# Altium schematic sheet Sheet2.SchDoc
size A3; SheetNumber: 2; SheetTotal: 2
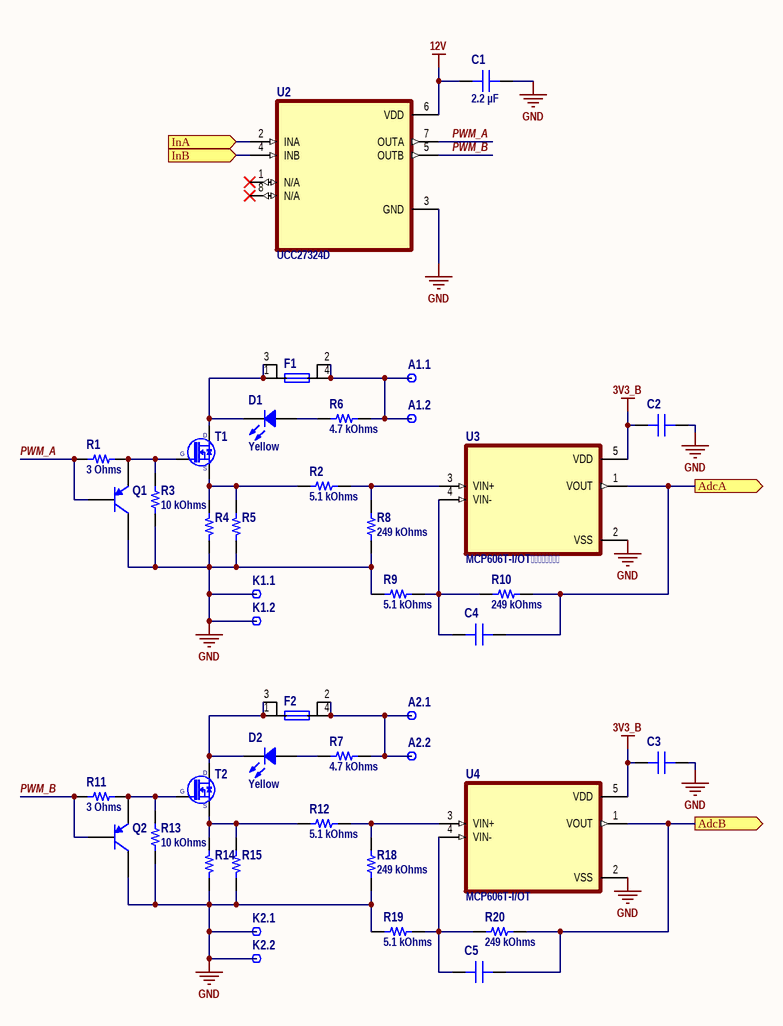
[diagram p0: Sheet2.SchDoc]

## Parts
A1.1  Plated Hole  [MTG240_400]  (value not drawn)
A1.2  Plated Hole  [MTG240_400]  (value not drawn)
A2.1  Plated Hole  [MTG240_400]  (value not drawn)
A2.2  Plated Hole  [MTG240_400]  (value not drawn)
C1  2.2 µF  [CAP 0805_2012]
C2  1000 pF  [CAP 0603_1608]  (value not drawn)
C3  1000 pF  [CAP 0603_1608]  (value not drawn)
C4  6800 pF  [CAP 0603_1608]  (value not drawn)
C5  6800 pF  [CAP 0603_1608]  (value not drawn)
D1  Yellow  [LED 0603_1608 YELLOW]
D2  Yellow  [LED 0603_1608 YELLOW]
F1  (no value)  [FUSR_LITTELFUSE_RHEF100 - duplicate]
F2  (no value)  [FUSR_LITTELFUSE_RHEF100 - duplicate]
K1.1  Plated Hole  [MTG240_400]  (value not drawn)
K1.2  Plated Hole  [MTG240_400]  (value not drawn)
K2.1  Plated Hole  [MTG240_400]  (value not drawn)
K2.2  Plated Hole  [MTG240_400]  (value not drawn)
Q1  FMMT718TA  [SOT-23B_N]  (value not drawn)
Q2  FMMT718TA  [SOT-23B_N]  (value not drawn)
R1  3 Ohms  [RES 0805_2012]
R2  5.1 kOhms  [RES 0603_1608]
R3  10 kOhms  [RES 0805_2012]
R4  10 mOhms  [RES 2512_6432]  (value not drawn)
R5  10 mOhms  [RES 2512_6432]  (value not drawn)
R6  4.7 kOhms  [RES 0603_1608]
R7  4.7 kOhms  [RES 0603_1608]
R8  249 kOhms  [RES 0603_1608]
R9  5.1 kOhms  [RES 0603_1608]
R10  249 kOhms  [RES 0603_1608]
R11  3 Ohms  [RES 0805_2012]
R12  5.1 kOhms  [RES 0603_1608]
R13  10 kOhms  [RES 0805_2012]
R14  10 mOhms  [RES 2512_6432]  (value not drawn)
R15  10 mOhms  [RES 2512_6432]  (value not drawn)
R18  249 kOhms  [RES 0603_1608]
R19  5.1 kOhms  [RES 0603_1608]
R20  249 kOhms  [RES 0603_1608]
T1  (no value)  [TO-220]
T2  (no value)  [TO-220]
U2  UCC27324D  [8-SOIC]
U3  MCP606T-I/OT  [SOT95P270X145-5N]
U4  MCP606T-I/OT  [SOT95P270X145-5N]

## Ports
AdcA (out), AdcB (out), InA (in), InB (in)

## Nets
3V3_B: C2.2 C3.2 U3.5(VDD) U4.5(VDD)
12V: C1.2 U2.6(VDD)
GND: C1.1 C2.1 C3.1 K1.1.1 K1.2.1 K2.1.1 K2.2.1 Q1.1(C) Q2.1(C) R3.1 R4.2 R5.2 R8.1 R9.1 R13.1 R14.2 R15.2 R18.1 R19.1 U2.3(GND) U3.2(VSS) U4.2(VSS)
AdcA: C4.2 R10.2 U3.1(VOUT) ; port AdcA
AdcB: C5.2 R20.2 U4.1(VOUT) ; port AdcB
InA: U2.2(INA) ; port InA
InB: U2.4(INB) ; port InB
PWM_A: Q1.2(B) R1.1 U2.7(OUTA)
PWM_B: Q2.2(B) R11.1 U2.5(OUTB)
NetA1.1_1: A1.1.1 A1.2.1 F1.2 F1.4 R6.2
NetA2.1_1: A2.1.1 A2.2.1 F2.2 F2.4 R7.2
NetC4_1: C4.1 R9.2 R10.1 U3.4(VIN-)
NetC5_1: C5.1 R19.2 R20.1 U4.4(VIN-)
NetD1_1: D1.1 R6.1
NetD1_2: D1.2 F1.1 F1.3 T1.2(D)
NetD2_1: D2.1 R7.1
NetD2_2: D2.2 F2.1 F2.3 T2.2(D)
NetQ1_3: Q1.3(E) R1.2 R3.2 T1.1(G)
NetQ2_3: Q2.3(E) R11.2 R13.2 T2.1(G)
NetR2_1: R2.1 R4.1 R5.1 T1.3(S)
NetR2_2: R2.2 R8.2 U3.3(VIN+)
NetR12_1: R12.1 R14.1 R15.1 T2.3(S)
NetR12_2: R12.2 R18.2 U4.3(VIN+)

Not connected (* = marked no-connect by the designer): U2 1(N/A)* 8(N/A)*

## Library data of the parts
A1.1 A1.2 A2.1 A2.2 K1.1 K1.2 K2.1 K2.2 = PLATED_HOLE2.4_PAD4.0: Single Terminal Socket; Part Description: Plated Through Hole: Hole Dia.=2.4mm Pad Dia.=4.0mm; Mounted: No; Part Number: PLATED_HOLE2.4_PAD4.0; Component Kind: Standard (No BOM); Component Type: Standard (No BOM); Pin Count: 1; Family: Plated Hole; Socket: No; SMD: No; Sense: No; Status: None; ComponentHeight: 0mm; HelpURL: Undefined; Author: CERN DEM JMW; CreateDate: 10.10.2011; LatestRevisionDate: 10.10.2011; PackageDescription: Plated Through Hole: Hole Dia.=2.4mm Pad Dia.=4.0mm
C1 = C0805C225K3PAC7800: CAP CER 2.2UF 25V X5R 0805; manufacturer: KEMET; Tolerance: ±10%; Part Number: C0805C225K3PAC7800; Value: 2.2 µF; Applications: General Purpose; Capacitance: 2.2 µF; componentlink1description: Datasheet; componentlink1url: https://api.kemet.com/component-edge/download/datasheet/C0805C225K3PAC7800.pdf; componentlink2description: DigiKey Link; componentlink2url: https://www.digikey.com/en/products/detail/kemet/C0805C225K3PAC7800/5267605; Device Package: 0805 (2012 Metric); lastupdated: 26.02.2022 9:08:50; Lifecycle Status: Active; Minimum Order: 1; Mounting Type: Surface Mount, MLCC; Operating Temperature: -55°C ~ 85°C; Package / Case: 0805 (2012 Metric); packaging: TapeAndReel; partid: 8494; Part Status: Active; price: 0.04; series: SMD Comm X5R; Size / Dimension: 0.079" L x 0.049" W (2.00mm x 1.25mm); Supplier 1: DigiKey; Supplier Part Number 1: 399-11940-1-ND; Temperature Coefficient: X5R; Thickness (Max): 0.055" (1.40mm); Voltage - Rated: 25V
C2 C3 = CC0603JPX7R9BB102: CAP CER 1000PF 50V X7R 0603; manufacturer: Yageo; Tolerance: ±5%; Part Number: CC0603JPX7R9BB102; Value: 1000 pF; Applications: General Purpose; Capacitance: 1000 pF; componentlink1description: Datasheet; componentlink1url: https://www.yageo.com/upload/media/product/productsearch/datasheet/mlcc/UPY-GPHC_X7R_6.3V-to-50V_20.pdf; componentlink2description: DigiKey Link; componentlink2url: https://www.digikey.com/en/products/detail/yageo/CC0603JPX7R9BB102/11490764; Device Package: 0603 (1608 Metric); lastupdated: 26.02.2022 9:05:02; Lifecycle Status: Active; Minimum Order: 1; Mounting Type: Surface Mount, MLCC; Operating Temperature: -55°C ~ 125°C; Package / Case: 0603 (1608 Metric); packaging: TapeAndReel; partid: 35065; Part Status: Active; price: 0.01; series: CC; Size / Dimension: 0.063" L x 0.031" W (1.60mm x 0.80mm); Supplier 1: DigiKey; Supplier Part Number 1: 13-CC0603JPX7R9BB102CT-ND; Temperature Coefficient: X7R; Thickness (Max): 0.035" (0.90mm); Voltage - Rated: 50V
C4 C5 = CC0603KRX7R8BB682: CAP CER 6800PF 25V X7R 0603; manufacturer: Yageo; Tolerance: ±10%; Part Number: CC0603KRX7R8BB682; Value: 6800 pF; Applications: General Purpose; Capacitance: 6800 pF; componentlink1description: Datasheet; componentlink1url: https://www.yageo.com/upload/media/product/productsearch/datasheet/mlcc/UPY-GPHC_X7R_6.3V-to-50V_18.pdf; componentlink2description: DigiKey Link; componentlink2url: https://www.digikey.com/en/products/detail/yageo/CC0603KRX7R8BB682/5883791; Device Package: 0603 (1608 Metric); lastupdated: 26.02.2022 9:05:31; Lifecycle Status: Active; Minimum Order: 1; Mounting Type: Surface Mount, MLCC; Operating Temperature: -55°C ~ 125°C; Package / Case: 0603 (1608 Metric); packaging: TapeAndReel; partid: 15819; Part Status: Active; price: 0.01; series: CC; Size / Dimension: 0.063" L x 0.031" W (1.60mm x 0.80mm); Supplier 1: DigiKey; Supplier Part Number 1: 311-4090-1-ND; Temperature Coefficient: X7R; Thickness (Max): 0.035" (0.90mm); Voltage - Rated: 25V
D1 D2 = XZM2CYK53W-1: LED YELLOW CLEAR 2SMD; Manufacturer: SunLED; Configuration: Standard; Current - Test: 20mA; Lens Color: Colorless; Lens Size: 1.10mm x 0.80mm; Lens Style: Rectangle with Flat Top; Millicandela Rating: 317mcd; Viewing Angle: 120°; Voltage - Forward (Vf) (Typ): 2V; Wavelength - Dominant: 590nm; Part Number: XZM2CYK53W-1; Color: Yellow; ComponentLink1Description: Datasheet; ComponentLink1URL: https://www.sunledusa.com/products/spec/XZM2CYK53W-1.pdf; ComponentLink2Description: DigiKey Link; ComponentLink2URL: http://digikey.com/product-detail/en/sunled/XZM2CYK53W-1/1497-1236-1-ND/5001283; Device Package: 0603 (1608 Metric); Height (Max): 0.75mm; LastUpdated: 02.09.2020 1:21:18; Lens Transparency: Clear; Lifecycle Status: Active; Minimum Order: 1; Mounting Type: Surface Mount; Package / Case: 0603 (1608 Metric); Packaging: TapeAndReel; PartId: 102; Part Status: Active; Price: 0.15; Series: -; Size / Dimension: 1.60mm L x 0.80mm W; Supplier 1: DigiKey; Supplier Part Number 1: 1497-1236-1-ND; Supplier Device Package: 2-SMD; Value: Yellow; Wavelength - Peak: 590nm
F1 F2 = Fuse_auto: Fuse
Q1 Q2 = PNP: PNP Bipolar Transistor; Published: 8-Jun-2000; LatestRevisionDate: 29-May-2009; LatestRevisionNote: IPC-7351 Footprint Added.; PackageVersion: Aug-1999; PackageReference: SOT-23B; Publisher: Altium Limited; PackageDescription: 3-Pin SOT-23 Package 0.95 mm Pitch, 2.4 mm Lead Span
R1 R11 = RC0805JR-073RL: RES 3 OHM 5% 1/8W 0805; Manufacturer: Yageo; Power (Watts): 0.125W, 1/8W; Temperature Coefficient: ±200ppm/°C; Part Number: RC0805JR-073RL; Value: 3 Ohms; ComponentLink1Description: Datasheet; ComponentLink1URL: https://www.yageo.com/upload/media/product/productsearch/datasheet/rchip/PYu-RC_Group_51_RoHS_L_10.pdf; ComponentLink2Description: DigiKey Link; ComponentLink2URL: https://www.digikey.com/en/products/detail/yageo/RC0805JR-073RL/728295; Composition: Thick Film; Device Package: 0805 (2012 Metric); Features: Moisture Resistant; Height - Seated (Max): 0.024" (0.60mm); LastUpdated: 28.02.2022 16:27:14; Lifecycle Status: Active; Minimum Order: 1; Number of Terminations: 2; Operating Temperature: -55°C ~ 155°C; Package / Case: 0805 (2012 Metric); Packaging: TapeAndReel; PartId: 28655; Part Status: Active; Price: 0.01; Resistance: 3 Ohms; Series: RC_L; Size / Dimension: 0.079" L x 0.049" W (2.00mm x 1.25mm); Supplier 1: DigiKey; Supplier Part Number 1: 311-3.0ARCT-ND; Supplier Device Package: 0805; Tolerance: ±5%
R2 R9 R12 R19 = TNPW06035K10BYEN: RES 5.1K OHM 0.1% 1/10W 0603; Manufacturer: Vishay Dale; Power (Watts): 0.125W, 1/8W; Temperature Coefficient: ±10ppm/°C; Part Number: TNPW06035K10BYEN; Value: 5.1 kOhms; ComponentLink1Description: Datasheet; ComponentLink1URL: http://www.vishay.com/docs/28758/tnpw_e3.pdf; ComponentLink2Description: DigiKey Link; ComponentLink2URL: http://digikey.com/product-detail/en/vishay-dale/TNPW06035K10BYEN/541-9831-1-ND/9562456; Composition: Thin Film; Device Package: 0603 (1608 Metric); Features: Anti-Sulfur, Automotive AEC-Q200, Moisture Resistant; Height - Seated (Max): 0.022" (0.55mm); LastUpdated: 26.02.2022 8:48:05; Lifecycle Status: Active; Minimum Order: 1; Number of Terminations: 2; Operating Temperature: -55°C ~ 155°C; Package / Case: 0603 (1608 Metric); Packaging: TapeAndReel; PartId: 5273; Part Status: Active; Price: 0.27; Ratings: AEC-Q200; Resistance: 5.1 kOhms; Series: TNPW e3; Size / Dimension: 0.061" L x 0.033" W (1.55mm x 0.85mm); Supplier 1: DigiKey; Supplier Part Number 1: 541-9831-1-ND; Supplier Device Package: 0603; Tolerance: ±0.1%
R3 R13 = RC0805JR-0710KP: RES SMD 10K OHM 5% 1/8W 0805; Manufacturer: Yageo; Power (Watts): 0.125W, 1/8W; Temperature Coefficient: ±100ppm/°C; Part Number: RC0805JR-0710KP; Value: 10 kOhms; ComponentLink1Description: Datasheet; ComponentLink1URL: http://www.yageo.com/NewPortal/yageodocoutput?fileName=/pdf/R-Chip/PYu-RC_51_RoHS_P_0.pdf; ComponentLink2Description: DigiKey Link; ComponentLink2URL: https://www.digikey.com/en/products/detail/yageo/RC0805JR-0710KP/4935344; Composition: Thick Film; Device Package: 0805 (2012 Metric); Features: Moisture Resistant; Height - Seated (Max): 0.024" (0.60mm); LastUpdated: 26.02.2022 8:57:19; Lifecycle Status: Active; Minimum Order: 1; Number of Terminations: 2; Operating Temperature: -55°C ~ 155°C; Package / Case: 0805 (2012 Metric); Packaging: TapeAndReel; PartId: 47029; Part Status: Active; Price: 0.01; Resistance: 10 kOhms; Series: RC-P Lead Free; Size / Dimension: 0.079" L x 0.049" W (2.00mm x 1.25mm); Supplier 1: DigiKey; Supplier Part Number 1: YAG1329CT-ND; Supplier Device Package: 0805; Tolerance: ±5%
R4 R5 R14 R15 = RL2512FK-070R01L: RES 0.01 OHM 1% 1W 2512; Manufacturer: Yageo; Temperature Coefficient: ±1500ppm/°C; Part Number: RL2512FK-070R01L; ComponentLink1Description: Datasheet; ComponentLink1URL: http://www.yageo.com/documents/recent/PYu-RL_Group_521_RoHS_L_2.pdf; ComponentLink2Description: DigiKey Link; ComponentLink2URL: https://www.digikey.com/en/products/detail/yageo/RL2512FK-070R01L/1037140; Composition: Thick Film; Device Package: 2512 (6432 Metric); Features: Automotive AEC-Q200, Current Sense, Moisture Resistant; Height - Seated (Max): 0.026" (0.65mm); LastUpdated: 17.02.2022 18:29:30; Lifecycle Status: Active; Minimum Order: 1; Number of Terminations: 2; Operating Temperature: -55°C ~ 155°C; Package / Case: 2512 (6432 Metric); Packaging: TapeAndReel; Part Status: Active; Power (Watts): 1W; Price: 0.15; Ratings: AEC-Q200; Resistance: 10 mOhms; Series: RL; Size / Dimension: 0.250" L x 0.126" W (6.35mm x 3.20mm); Supplier 1: DigiKey; Supplier Part Number 1: 311-.010TCT-ND; Supplier Device Package: 2512; Tolerance: ±1%; Value: 10 mOhms
R6 R7 = RC0603JR-134K7L: RES 4.7K OHM 5% 1/10W 0603; Manufacturer: Yageo; Power (Watts): 0.1W, 1/10W; Temperature Coefficient: ±100ppm/°C; Part Number: RC0603JR-134K7L; Value: 4.7 kOhms; ComponentLink1Description: Datasheet; ComponentLink1URL: https://www.yageo.com/upload/media/product/productsearch/datasheet/rchip/PYu-RC_Group_51_RoHS_L_11.pdf; ComponentLink2Description: DigiKey Link; ComponentLink2URL: https://www.digikey.com/en/products/detail/yageo/RC0603JR-134K7L/13694157; Composition: Thick Film; Device Package: 0603 (1608 Metric); Features: Moisture Resistant; Height - Seated (Max): 0.022" (0.55mm); LastUpdated: 26.02.2022 8:46:15; Lifecycle Status: Active; Minimum Order: 1; Number of Terminations: 2; Operating Temperature: -55°C ~ 155°C; Package / Case: 0603 (1608 Metric); Packaging: CutTape; PartId: 65433; Part Status: Active; Price: 0.01; Resistance: 4.7 kOhms; Series: RC_L; Size / Dimension: 0.063" L x 0.031" W (1.60mm x 0.80mm); Supplier 1: DigiKey; Supplier Part Number 1: 13-RC0603JR-134K7LCT-ND; Supplier Device Package: 0603; Tolerance: ±5%
R8 R10 R18 R20 = RT0603BRD07249KL: RES SMD 249K OHM 0.1% 1/10W 0603; Manufacturer: Yageo; Power (Watts): 0.1W, 1/10W; Temperature Coefficient: ±25ppm/°C; Part Number: RT0603BRD07249KL; Value: 249 kOhms; ComponentLink1Description: Datasheet; ComponentLink1URL: https://www.yageo.com/upload/media/product/productsearch/datasheet/rchip/PYu-RT_1-to-0.01_RoHS_L_11.pdf; ComponentLink2Description: DigiKey Link; ComponentLink2URL: http://digikey.com/product-detail/en/yageo/RT0603BRD07249KL/YAG4510CT-ND/6616666; Composition: Thin Film; Device Package: 0603 (1608 Metric); Height - Seated (Max): 0.022" (0.55mm); LastUpdated: 26.02.2022 8:47:50; Lifecycle Status: Active; Minimum Order: 1; Number of Terminations: 2; Operating Temperature: -55°C ~ 155°C; Package / Case: 0603 (1608 Metric); Packaging: TapeAndReel; PartId: 10542; Part Status: Active; Price: 0.04; Resistance: 249 kOhms; Series: RT; Size / Dimension: 0.063" L x 0.031" W (1.60mm x 0.80mm); Supplier 1: DigiKey; Supplier Part Number 1: YAG4510CT-ND; Supplier Device Package: 0603; Tolerance: ±0.1%
T1 T2 = N-MOSFET-D 1D 2G 3S: N-CHANNEL MOSFET WITH DIODE
U3 U4 = MCP6001T-E/OT: General Purpose Amplifier 1 Circuit Rail-to-Rail SOT-23-5; MF: Microchip; Package: SOT-23-5 Microchip; Value: *; SnapEDA_Link: https://www.snapeda.com/parts/MCP6001T-E/OT/Microchip/view-part/235076/?ref=snap; Availability: Unavailable; MP: MCP6001T-E/OT; Price: None
U2 = UCC27324D: Package: None; Price: None; Value: *; MP: UCC27324D; Availability: Unavailable